# EAGLE schematic schematic (EAGLE 9.7.0)
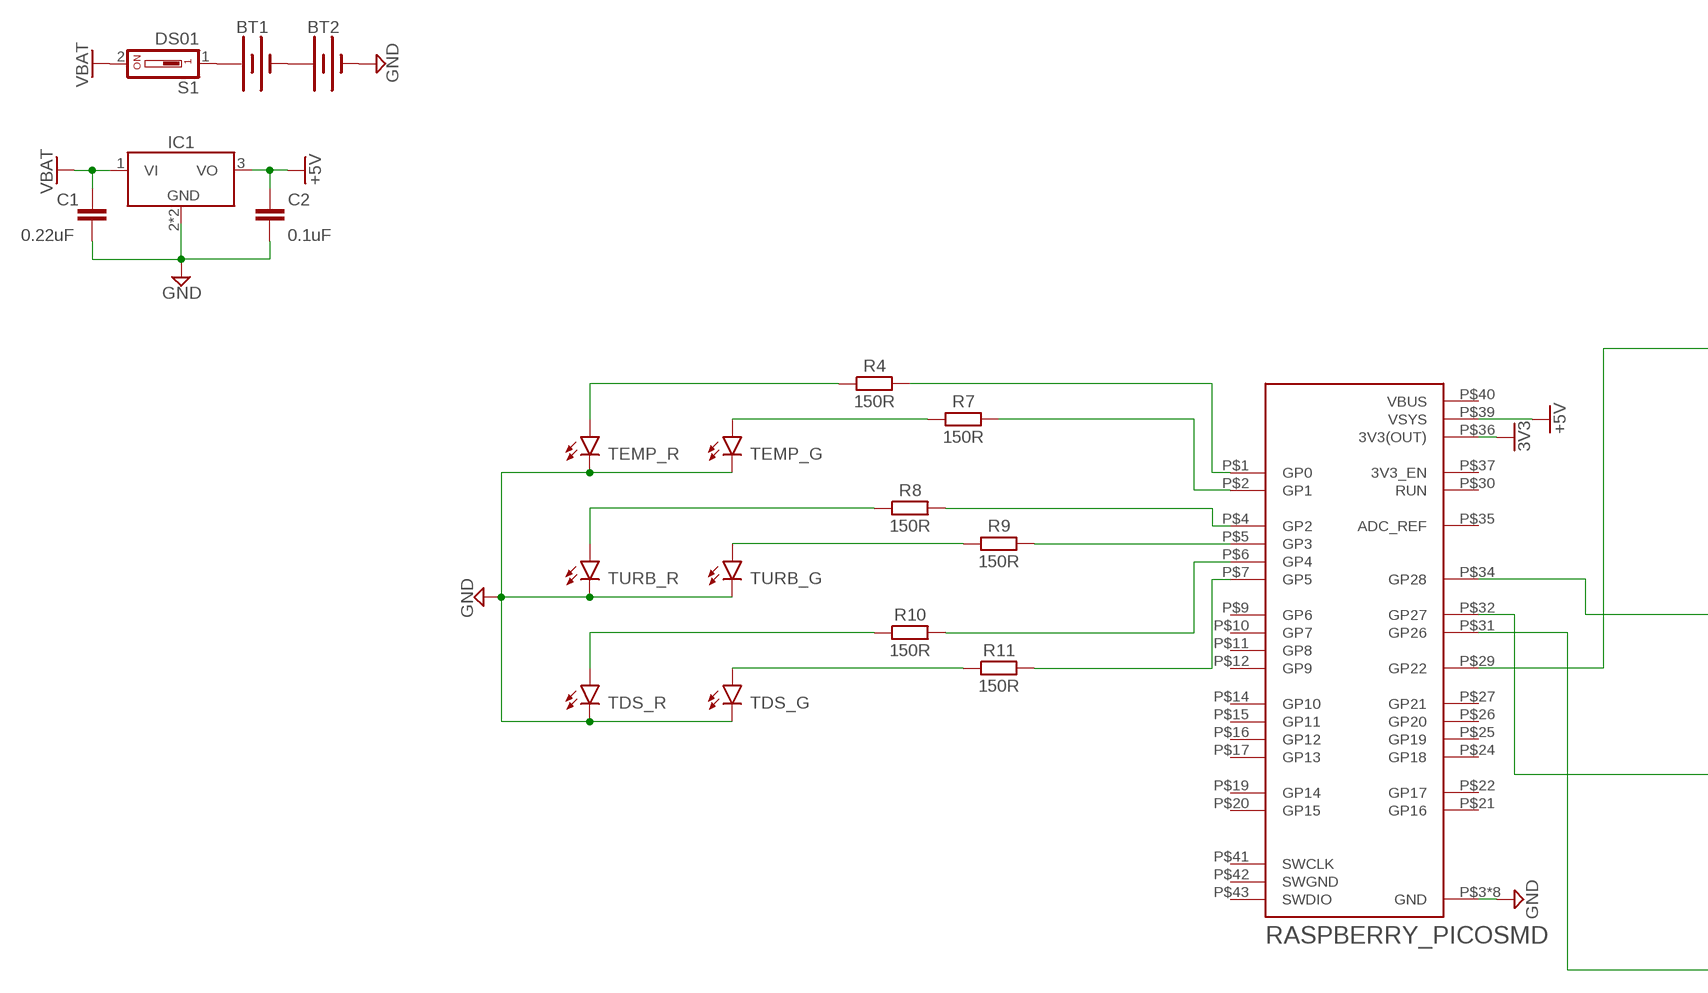
[diagram p0: schematic, sheet 1, part 1 of 2]
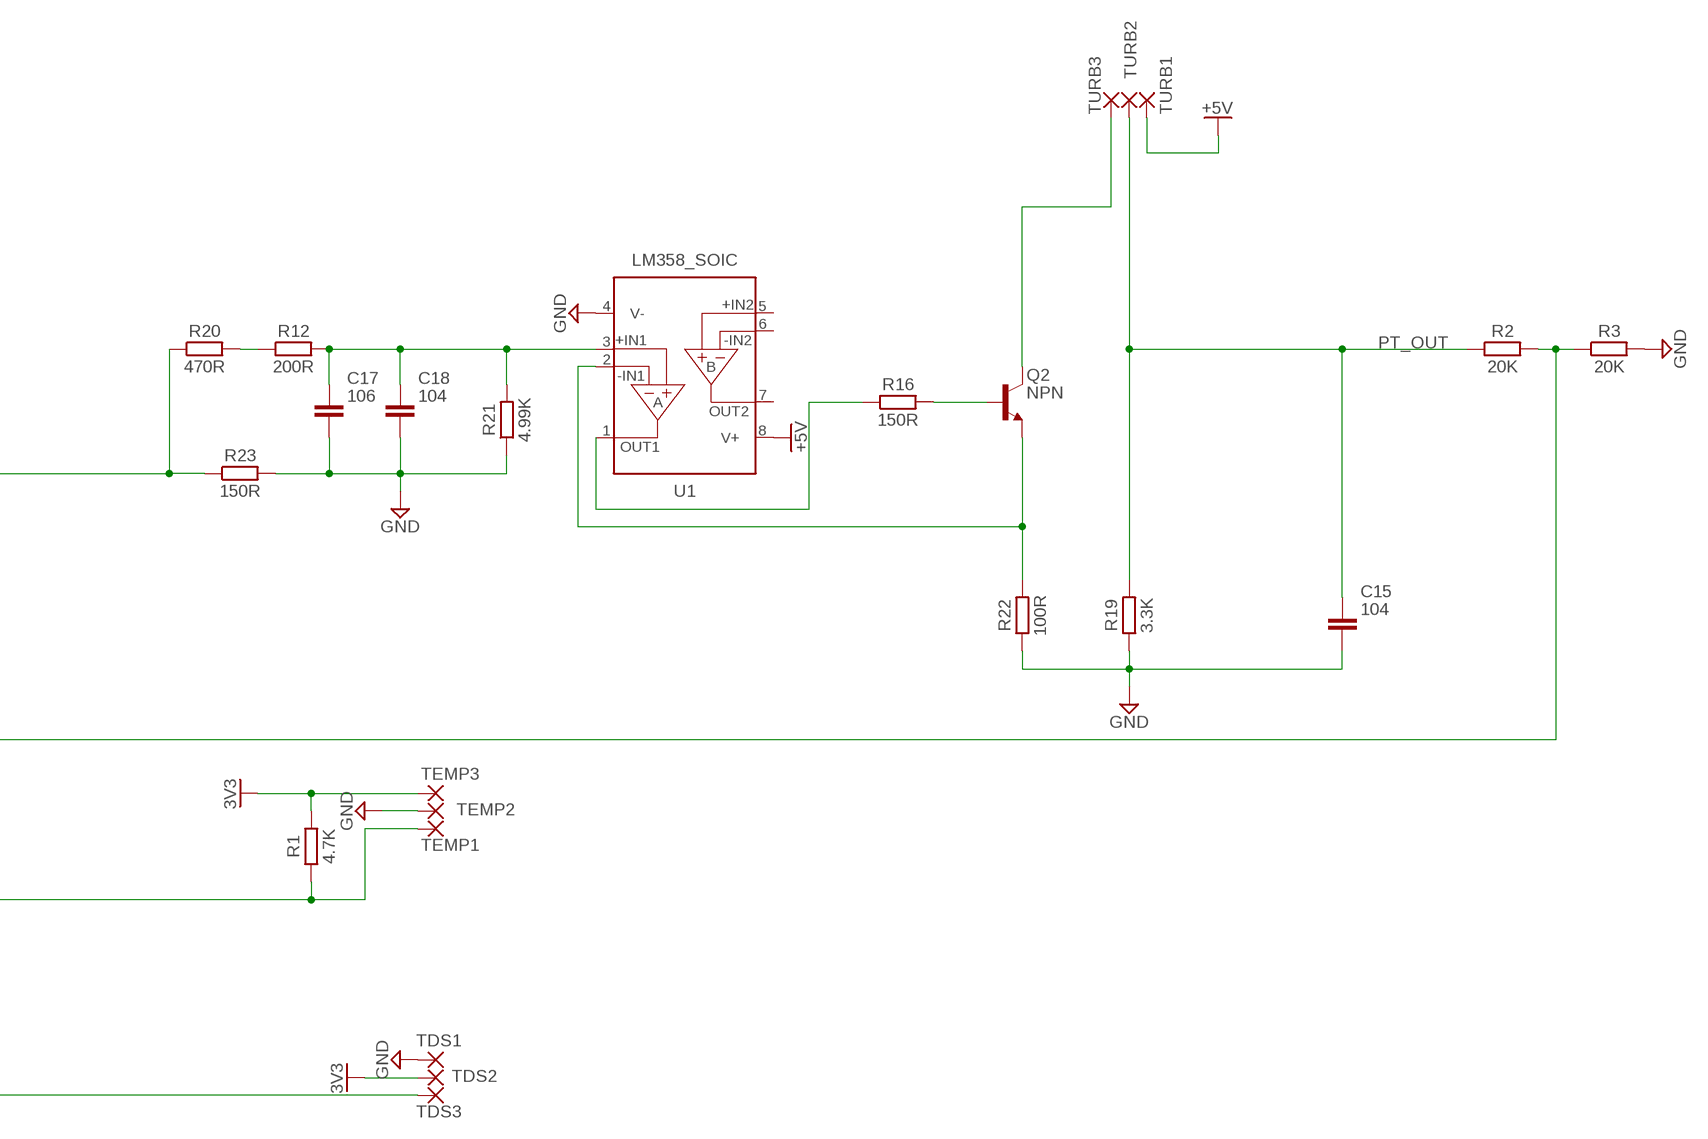
[diagram p1: schematic, sheet 1, part 2 of 2]

## Parts
BT1  BATTERY-20MM_SMD_4LEGS  [BATTCON_20MM_4LEGS]
BT2  BATTERY-20MM_SMD_4LEGS  [BATTCON_20MM_4LEGS]
C1  0.22uF  C_CHIP-0603(1608-METRIC)  [CAPC1608X85]
C2  0.1uF  C_CHIP-0603(1608-METRIC)  [CAPC1608X85]
C15  104  C_CHIP-0402(1005-METRIC)  [CAPC1005X60]
C17  106  C_CHIP-0402(1005-METRIC)  [CAPC1005X60]
C18  104  C_CHIP-0402(1005-METRIC)  [CAPC1005X60]
IC1  LM7805_SOT223  [SOT230P700X170-4]
Q2  NPN  NPN_SOT23-BEC  [SOT95P237X112-3N]
R1  4.7K  R_CHIP-0402(1005-METRIC)  [RESC1005X40]
R2  20K  R_CHIP-0402(1005-METRIC)  [RESC1005X40]
R3  20K  R_CHIP-0402(1005-METRIC)  [RESC1005X40]
R4  150R  R_CHIP-0402(1005-METRIC)  [RESC1005X40]
R7  150R  R_CHIP-0402(1005-METRIC)  [RESC1005X40]
R8  150R  R_CHIP-0402(1005-METRIC)  [RESC1005X40]
R9  150R  R_CHIP-0402(1005-METRIC)  [RESC1005X40]
R10  150R  R_CHIP-0402(1005-METRIC)  [RESC1005X40]
R11  150R  R_CHIP-0402(1005-METRIC)  [RESC1005X40]
R12  200R  R_CHIP-0402(1005-METRIC)  [RESC1005X40]
R16  150R  R_CHIP-0402(1005-METRIC)  [RESC1005X40]
R19  3.3K  R_CHIP-0402(1005-METRIC)  [RESC1005X40]
R20  470R  R_CHIP-0402(1005-METRIC)  [RESC1005X40]
R21  4.99K  R_CHIP-0603(1608-METRIC)  [RESC1608X60]
R22  100R  R_CHIP-0402(1005-METRIC)  [RESC1005X40]
R23  150R  R_CHIP-0402(1005-METRIC)  [RESC1005X40]
S1  DS01  [DS-01]
TDS1  SMD5  [SMD2,54-5,08]
TDS2  SMD5  [SMD2,54-5,08]
TDS3  SMD5  [SMD2,54-5,08]
TDS_G  CHIP-ROUND-G_0805  [LEDC2012X105N_RND-G]
TDS_R  CHIP-ROUND-R_0805  [LEDC2012X105N_RND-R]
TEMP1  SMD5  [SMD2,54-5,08]
TEMP2  SMD5  [SMD2,54-5,08]
TEMP3  SMD5  [SMD2,54-5,08]
TEMP_G  CHIP-ROUND-G_0805  [LEDC2012X105N_RND-G]
TEMP_R  CHIP-ROUND-R_0805  [LEDC2012X105N_RND-R]
TURB1  SMD5  [SMD2,54-5,08]
TURB2  SMD5  [SMD2,54-5,08]
TURB3  SMD5  [SMD2,54-5,08]
TURB_G  CHIP-ROUND-G_0805  [LEDC2012X105N_RND-G]
TURB_R  CHIP-ROUND-R_0805  [LEDC2012X105N_RND-R]
U1  LM358_SOIC  [SOIC127P600X175-8N]
U2  RASPBERRY_PICOSMD  [PICO-PKG-SMD]

## Nets
3V3: R1.2 TDS2.1(P) TEMP3.1(P) U2.P$36(3V3(OUT))
+5V: C2.1 IC1.3(VO) TURB1.1(P) U1.8(V+) U2.P$39(VSYS)
GND: BT2.NEGATIVE(-) C1.2 C2.2 C15.2 C17.2 C18.2 IC1.2(GND) IC1.4(GND) R3.2 R19.1 R21.1 R22.1 R23.2 TDS1.1(P) TDS_G.C TDS_R.C TEMP2.1(P) TEMP_G.C TEMP_R.C TURB_G.C TURB_R.C U1.4(V-) U2.P$3(GND) U2.P$8(GND) U2.P$13(GND) U2.P$18(GND) U2.P$23(GND) U2.P$28(GND) U2.P$33(GND) U2.P$38(GND)
N$1: R8.2 U2.P$4(GP2)
N$2: R9.2 U2.P$5(GP3)
N$3: R1.1 TEMP1.1(P) U2.P$32(GP27)
N$4: R20.1 R23.1 U2.P$29(GP22)
N$6: R2.2 R3.1 U2.P$34(GP28)
N$7: TDS3.1(P) U2.P$31(GP26)
N$8: R4.1 TEMP_R.A
N$9: R7.1 TEMP_G.A
N$10: R8.1 TURB_R.A
N$11: R9.1 TURB_G.A
N$12: R11.1 TDS_G.A
N$13: BT1.NEGATIVE(-) BT2.POSITIVE@1(+) BT2.POSITIVE@2(+) BT2.POSITIVE@3(+) BT2.POSITIVE@4(+)
N$14: R11.2 U2.P$7(GP5)
N$15: R10.2 U2.P$6(GP4)
N$16: BT1.POSITIVE@1(+) BT1.POSITIVE@2(+) BT1.POSITIVE@3(+) BT1.POSITIVE@4(+) S1.1
N$17: R4.2 U2.P$1(GP0)
N$18: R7.2 U2.P$2(GP1)
N$21: R10.1 TDS_R.A
N$23: R12.1 R20.2
N$45: C17.1 C18.1 R12.2 R21.2 U1.3(+IN1)
N$47: R16.1 U1.1(OUT1)
N$48: Q2.1(B) R16.2
N$49: Q2.2(E) R22.2 U1.2(-IN1)
N$50: Q2.3(C) TURB3.1(P)
PT_OUT: C15.1 R2.1 R19.2 TURB2.1(P)
VBAT: C1.1 IC1.1(VI) S1.2
Unconnected: U1.5(+IN2) U1.6(-IN2) U1.7(OUT2) U2.P$9(GP6) U2.P$10(GP7) U2.P$11(GP8) U2.P$12(GP9) U2.P$14(GP10) U2.P$15(GP11) U2.P$16(GP12) U2.P$17(GP13) U2.P$19(GP14) U2.P$20(GP15) U2.P$21(GP16) U2.P$22(GP17) U2.P$24(GP18) U2.P$25(GP19) U2.P$26(GP20) U2.P$27(GP21) U2.P$30(RUN) U2.P$35(ADC_REF) U2.P$37(3V3_EN) U2.P$41(SWCLK) U2.P$43(SWDIO)

## Power pins joined to a net without a drawn wire
SWGND: U2.P$42(SWGND)
VBUS: U2.P$40(VBUS)

## Library data of the parts
BT1 BT2 = SparkFun-Batteries:BATTERY: Battery - Single Cell A variety of battery chemistries, sizes, and footprints. Device List: 20MM_PTH - Coin Cell Battery Holder - 20mm (PTH) <https://www.sparkfun.com/products/783> 20MM_PTH_KIT- Coin Cell battery Holder - 20 mm (PTH) <http://www.sparkfun.com/products/783>kit version with special mask 6.8MM_PTH - Coin Cell Battery Holder - 6.8MM(SMD) <https://www.digikey.com/product-detail/en/seiko-instruments/MS621FE-FL11E/728-1057-ND/1889208?WT.srch=1&gclid=CNOQ5a6LzdQCFZS2wAodXCkE0g> 12MM_SMD - Coin Cell Battery Holder - 12mm (SMD) <https://www.sparkfun.com/products/10592> 12MM_PTH - Coin Cell Battery Holder - 12mm (PTH) <https://www.sparkfun.com/products/7948> 20MM_SMD - 20mm Coin Cell Battery Holder (SMD) (2 legs) Used on the Big Time Watch Kit <https://www.sparkfun.com/products/11734> 20MM_SMD_4LEGS - Coin Cell Battery Holder - 20mm (SMD) <https://www.sparkfun.com/products/11892> 20MM_SMD_4LEGS_OVERPASTE - Coin Cell Battery Holder - 20mm (SMD) <https://www.sparkfun.com/products/11892> (Over-paste on the legs) 24.5MM_PTH - Coin Cell Battery Holder - 24.5mm (PTH) <https://www.sparkfun.com/products/8863> 9V - 9V Battery Holder - PC Mount Used on the SparkFun SparkPunk Sound Kit <https://www.sparkfun.com/products/11177> and SparkFun SparkPunk Sequencer Kit <https://www.sparkfun.com/products/12707> 18650 - Battery Holder - 18650 (PTH) <https://www.sparkfun.com/products/13113> AA - Battery Holder - 1xAA (PTH) <https://www.sparkfun.com/products/7949> AAA - Battery Holder - 1xAAA (PTH) <https://www.sparkfun.com/products/12718> AA_KIT - Battery Holder - 1xAA (PTH) <https://www.sparkfun.com/products/7949> Special kit package - pads only have exposed copper on one side of the board. AAA_KIT - Battery Holder - 1xAAA (PTH) <https://www.sparkfun.com/products/12718> Special kit package - pads only have exposed copper on one side of the board.; PROD_ID: BATT-10373; SF_SKU: PRT-11892
C1 C2 C15 C17 C18 = Capacitor:C: Capacitor - Generic; CATEGORY: Capacitor
IC1 = IC_Power-Management:LM7805: 5V Voltage Regulator Reference Datasheet <https://www.ti.com/lit/ds/symlink/lm340.pdf>; CATEGORY: IC_Logic; DESCRIPTION: 5V Voltage Regulator; MANUFACTURER: Generic; MPN: Generic; SERIES: LM7805; SUB-CATEGORY: Voltage Regulator; TYPE: 5V
Q2 = Transistor:NPN: NPN - Generic; CATEGORY: Transistor; SUB-CATEGORY: BJT; TYPE: NPN
R1-R4 R7-R12 R16 R19-R23 = Resistor:R: Resistor Fixed - Generic; CATEGORY: Resistor; SUB-CATEGORY: Fixed
S1 = Switch:DS01: DIL/CODE SWITCH; CATEGORY: SWITCH; TYPE: SPST
TDS1-TDS3 TEMP1-TEMP3 TURB1-TURB3 = wirepad:SMD5: SMD PAD
TDS_G TEMP_G TURB_G = LED:CHIP-ROUND-G; CATEGORY: LED; COLOR: GREEN; DESCRIPTION: CHIP LED ROUND; SUB-CATEGORY: CHIP; TYPE: ROUND_TOP; VALUE: LED_GREEN
TDS_R TEMP_R TURB_R = LED:CHIP-ROUND-R: LED - Generic; CATEGORY: LED; COLOR: RED; DESCRIPTION: CHIP LED ROUND; SUB-CATEGORY: CHIP; TYPE: ROUND_TOP; VALUE: LED_RED
U1 = IC_Linear:LM358: Dual Operational Amplifier Reference Datasheet <https://www.ti.com/lit/ds/symlink/lm158-n.pdf>; CATEGORY: Amplifier; DESCRIPTION: Dual Operational Amplifier; MANUFACTURER: Generic; MPN: Generic; SERIES: LM358; SUB-CATEGORY: OpAmp; TYPE: Dual
U2 = RPI Pico Eagle lib:RASPBERRY_PICO: Raspberry Pi Pico